# Altium schematic sheet SD.SchDoc
size B
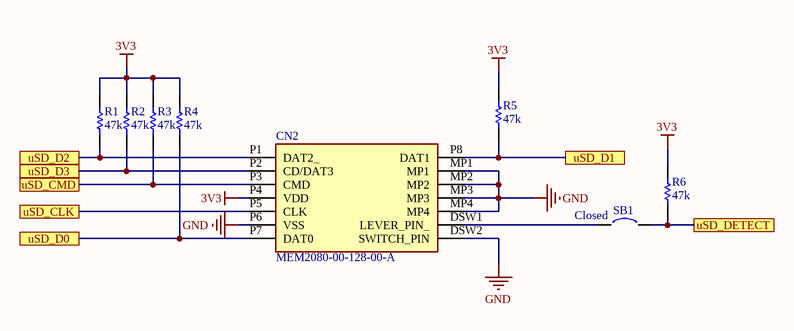
[diagram p0: SD.SchDoc]

## Parts
CN2  MEM2080-00-128-00-A  [MEM20800012800A]
R1  value 47k  [1608[0603]]  (hidden comment: Res1)
R2  value 47k  [1608[0603]]  (hidden comment: Res1)
R3  value 47k  [1608[0603]]  (hidden comment: Res1)
R4  value 47k  [1608[0603]]  (hidden comment: Res1)
R5  value 47k  [1608[0603]]  (hidden comment: Res1)
R6  value 47k  [1608[0603]]  (hidden comment: Res1)
SB1  Closed  [SB_0603]

## Ports
uSD_CLK, uSD_CMD, uSD_D0, uSD_D1, uSD_D2, uSD_D3, uSD_DETECT

## Nets
3V3: CN2.P4(VDD) R1.1 R2.1 R3.1 R4.1 R5.1 R6.2
GND: CN2.DSW2(SWITCH_PIN) CN2.MP1 CN2.MP2 CN2.MP3 CN2.MP4 CN2.P6(VSS)
uSD_CLK: CN2.P5(CLK) ; port uSD_CLK
uSD_CMD: CN2.P3(CMD) R3.2 ; port uSD_CMD
uSD_D0: CN2.P7(DAT0) R4.2 ; port uSD_D0
uSD_D1: CN2.P8(DAT1) R5.2 ; port uSD_D1
uSD_D2: CN2.P1(DAT2_) R1.2 ; port uSD_D2
uSD_D3: CN2.P2(CD/DAT3) R2.2 ; port uSD_D3
uSD_DETECT: R6.1 SB1.2 ; port uSD_DETECT
NetCN2_DSW1: CN2.DSW1(LEVER_PIN_) SB1.1

## Library data of the parts
CN2 = MEM2080-00-128-00-A: Connector; Manufacturer_Name: GCT (GLOBAL CONNECTOR TECHNOLOGY); Datasheet Link: https://gct.co/newark/connector/MEM2080; Height: 1.48mm; Manufacturer_Part_Number: MEM2080-00-128-00-A; Mouser Part Number: 640-MEM2080-0012800A; Mouser Price/Stock: https://www.mouser.co.uk/ProductDetail/GCT/MEM2080-00-128-00-A?qs=vvQtp7zwQdPJXzpf1SnYug%3D%3D
R1-R6 = Res1: Resistor; Published: 8-Jun-2000; LatestRevisionDate: 17-Jul-2002; LatestRevisionNote: Re-released for DXP Platform.; PackageReference: AXIAL-0.3; Publisher: Altium Limited; PackageDescription: Axial Device, Thru-Hole; 2 Leads; 0.3 in Pin Spacing
SB1 = Circuit Breaker: Published: 24-Mar-1999; Revision: July-2002: Re-released for DXP Platform.; Publisher: Altium Limited